# EAGLE design HAP-USB-Opto-1.0 (EAGLE 5.06)
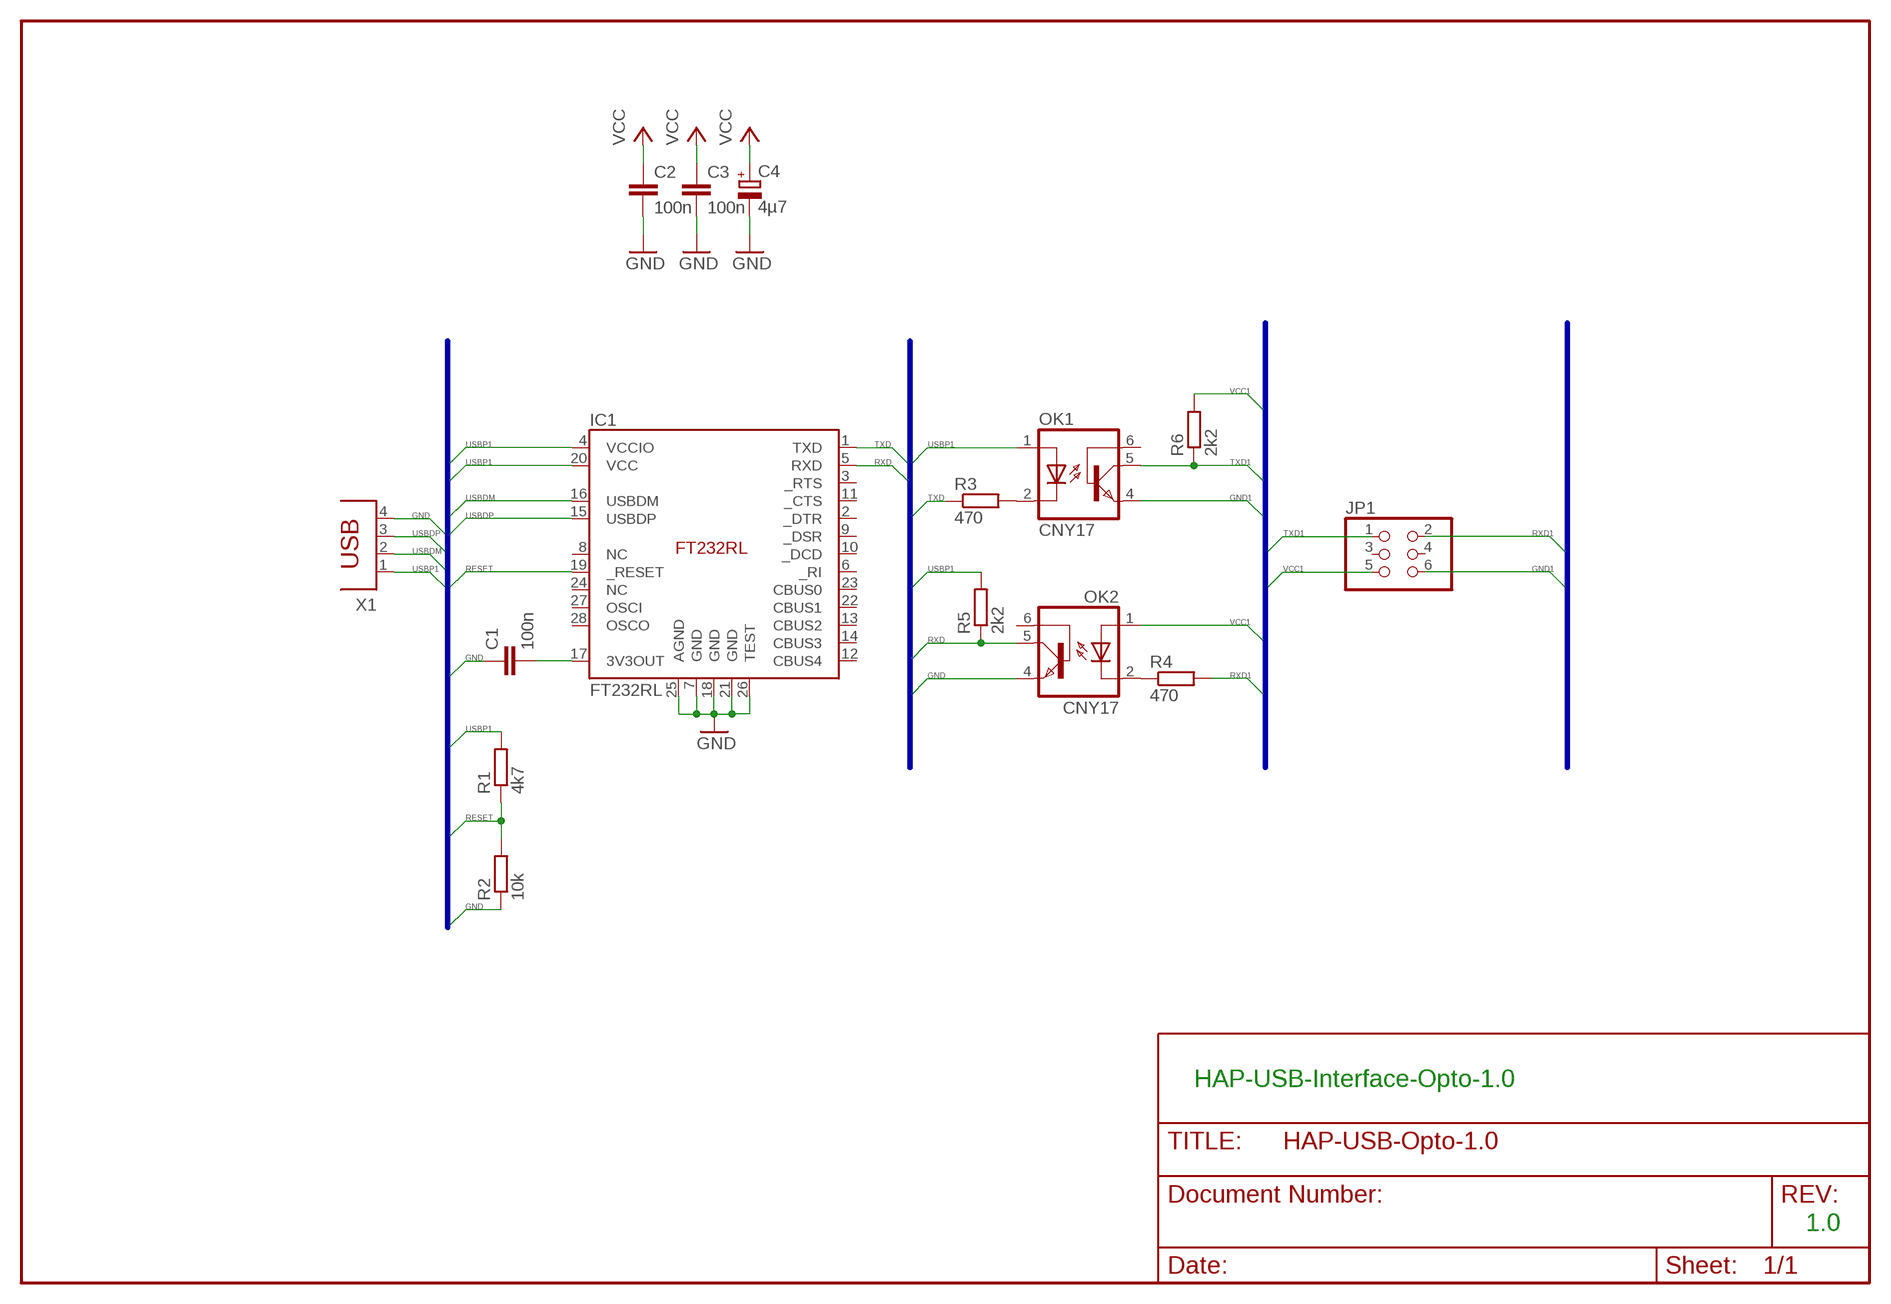
[diagram p0: schematic, sheet 1]

## Parts
C1  100n  C-EUC0805  [C0805]
C2  100n  C-EUC0805  [C0805]
C3  100n  C-EUC0805  [C0805]
C4  4µ7  CPOL-EUE2,5-6E  [E2,5-6E]
IC1  FT232RL  [SSOP-28]
JP1  PINHD-2X3  [2X03]
OK1  CNY17  [DIL06]
OK2  CNY17  [DIL06]
R1  4k7  R-EU_R0805  [R0805]
R2  10k  R-EU_R0805  [R0805]
R3  470  R-EU_R0805  [R0805]
R4  470  R-EU_R0805  [R0805]
R5  2k2  R-EU_R0805  [R0805]
R6  2k2  R-EU_R0805  [R0805]
X1  PN61729  [PN61729]

## Nets
GND: C1.1 C2.2 C3.2 C4.- IC1.7(GND) IC1.18(GND) IC1.21(GND) IC1.25(AGND) IC1.26(TEST) OK2.4(EMI) R2.1 X1.4
GND1: JP1.6 OK1.4(EMI)
N$1: OK1.2(C) R3.2
N$2: C1.2 IC1.17(3V3OUT)
N$3: OK2.2(C) R4.1
RESET: IC1.19(_RESET) R1.1 R2.2
RXD: IC1.5(RXD) OK2.5(COL) R5.1
RXD1: JP1.2 R4.2
TXD: IC1.1(TXD) R3.1
TXD1: JP1.1 OK1.5(COL) R6.1
USBDM: IC1.16(USBDM) X1.2
USBDP: IC1.15(USBDP) X1.3
USBP1: C2.1 C3.1 C4.+ IC1.4(VCCIO) IC1.20(VCC) OK1.1(A) R1.2 R5.2 X1.1 ; supply symbol labelled VCC
VCC1: JP1.5 OK2.1(A) R6.2
Unconnected: IC1.2(_DTR) IC1.3(_RTS) IC1.6(_RI) IC1.8(NC) IC1.9(_DSR) IC1.10(_DCD) IC1.11(_CTS) IC1.12(CBUS4) IC1.13(CBUS2) IC1.14(CBUS3) IC1.22(CBUS1) IC1.23(CBUS0) IC1.24(NC) IC1.27(OSCI) IC1.28(OSCO) JP1.3 JP1.4 OK1.6(BAS) OK2.6(BAS)

## Buses
VCC,GND,TXD,RXD,USBDM,USBDP,RESET,USBP1
B$1
B$2

## Notes on the sheet
- HAP-USB-Interface-Opto-1.0
- 1.0

## Library data of the parts
C1-C3 = rcl:C-EU: CAPACITOR, European symbol
C4 = rcl:CPOL-EU: POLARIZED CAPACITOR, European symbol
IC1 = ftdi4:FT232RL
JP1 = pinhead:PINHD-2X3: PIN HEADER
OK1 OK2 = optocoupler:CNY17: SIEMENS OPTO COUPLER
R1 R2 = rcl:R-EU_: RESISTOR, European symbol
R3-R6 = resistor:R-EU_: RESISTOR, European symbol
X1 = con-berg:PN61729: BERG USB connector

## Board
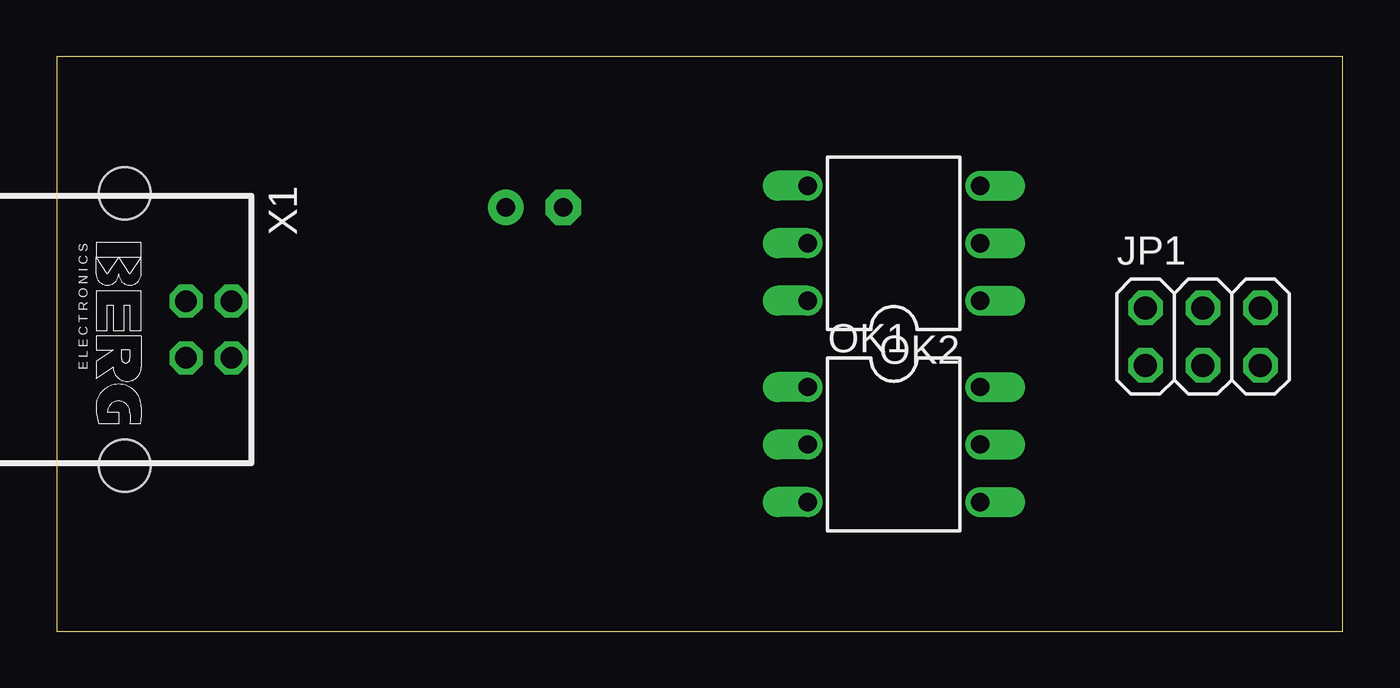
[diagram p1: board, top side]
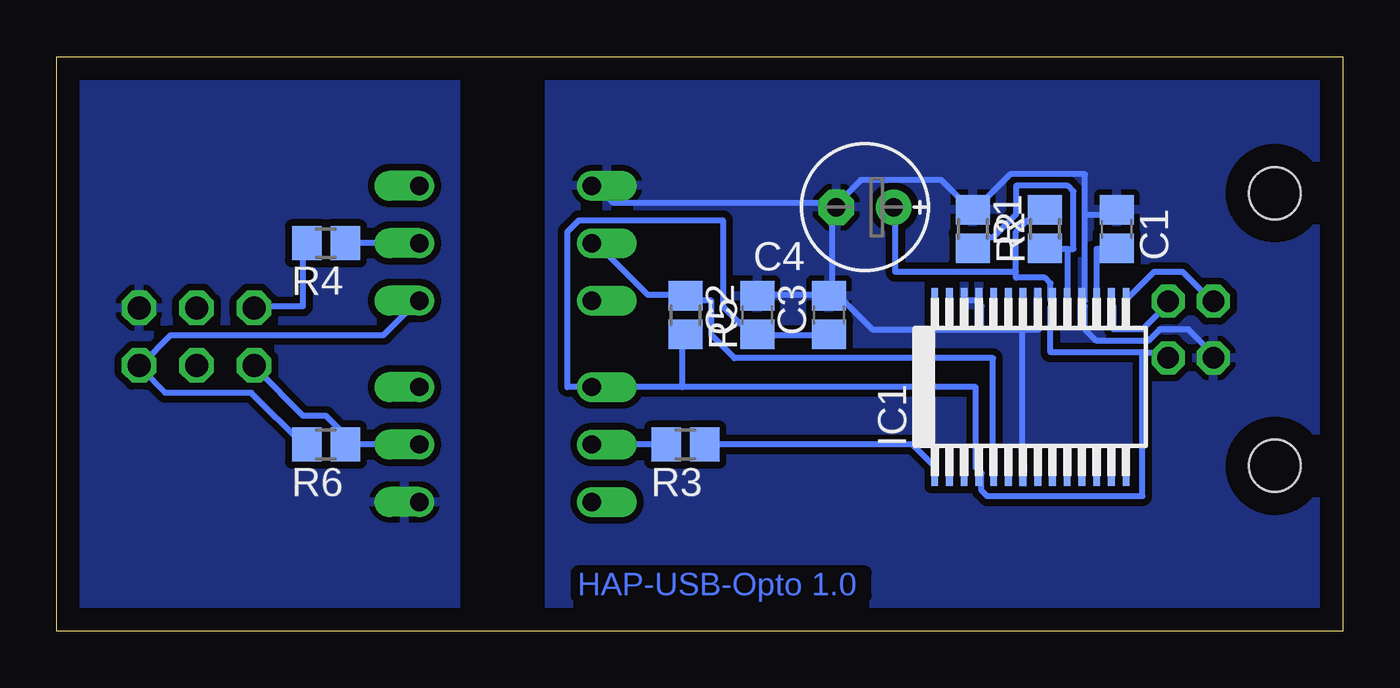
[diagram p2: board, bottom side, seen from below]

Size 56.82 x 25.39 mm. Coordinates in mm from the lower left corner, seen from the top.
Outline: 0,0 56.82,0 56.82,25.39 0,25.39 0,0
Copper layers (1*16): Top 0.035mm / dielectric 1.5mm / Bottom 0.035mm
Design rules "default": minimum track width 10mil, minimum drill 24mil, track to track 8mil, track to pad 8mil, pad to pad 8mil, via to via 8mil, smd to smd 8mil, copper to edge 40mil, drill to drill 8mil, minimum pad ring 10mil, minimum via ring 8mil, stop-mask expansion 4mil, vias tented up to drill 0mil, thermal gap 10mil

### Footprints (pad centres in the part's own frame; a part is rotated, then mirrored left to right if it is on the bottom)
C0805 = smd 1.3 x 1.5: 1 -0.85,0; 2 0.85,0
E2,5-6E = drill 0.813 pad 1.575 round: + -1.27,0 | drill 0.813 pad 1.575 octagon: - 1.27,0
SSOP-28 = smd 0.3 x 1.5: 1 -4.225,-3.625; 2 -3.575,-3.625; 3 -2.925,-3.625; 4 -2.275,-3.625; 5 -1.625,-3.625; 6 -0.975,-3.625; 7 -0.325,-3.625; 8 0.325,-3.625; 9 0.975,-3.625; 10 1.625,-3.625; 11 2.275,-3.625; 12 2.925,-3.625; 13 3.575,-3.625; 14 4.225,-3.625; 15 4.225,3.625; 16 3.575,3.625; 17 2.925,3.625; 18 2.275,3.625; 19 1.625,3.625; 20 0.975,3.625; 21 0.325,3.625; 22 -0.325,3.625; 23 -0.975,3.625; 24 -1.625,3.625; 25 -2.275,3.625; 26 -2.925,3.625; 27 -3.575,3.625; 28 -4.225,3.625
2X03 = drill 1.016 octagon: 1 -2.54,-1.27; 2 -2.54,1.27; 3 0,-1.27; 4 0,1.27; 5 2.54,-1.27; 6 2.54,1.27
DIL06 = drill 0.813 offset: 1 -2.54,-3.81; 2 0,-3.81; 3 2.54,-3.81; 4 2.54,3.81; 5 0,3.81; 6 -2.54,3.81
R0805 = smd 1.3 x 1.5: 1 -0.85,0; 2 0.85,0
PN61729 = drill 0.95 octagon: 1 1.25,4.71; 2 -1.25,4.71; 3 -1.25,2.71; 4 1.25,2.71 | hole 2.3: -6.02,0; 6.02,0

### Placement (x,y rotation side)
C1  10,17.77 270 bottom
C2  25.87,13.96 90 bottom
C3  22.7,13.96 90 bottom
C4  21.11,18.73 180 bottom
IC1  13.81,10.79 0 bottom
JP1  50.63,13.01 0 top
OK1  36.98,8.25 270 top
OK2  36.98,17.14 90 top
R1  13.17,17.77 90 bottom
R2  16.34,17.77 270 bottom
R3  29.04,8.25 180 bottom
R4  44.92,17.14 180 bottom
R5  29.04,13.96 270 bottom
R6  44.92,8.25 180 bottom
X1  3.01,13.33 270 top

### Tracks (layer width: path | path; a pad name or v marks a point on that pad's centre or on a via)
GND
  Bottom 0.254: 11.39,18.41 11.39,14.6 IC1.18 11.39,14.35 11.39,13.33 10.88,12.82 8.6,12.82 8.09,13.33 6.82,13.33 5.8,12.31 X1.4 | 11.39,18.41 10.12,18.41 C1.1 | 15.96,13.33 14.19,13.33 | 14.19,13.33 13.42,13.33 13.42,14.35 IC1.21 | 15.96,13.33 15.96,14.35 IC1.25 16.22,14.6 16.73,14.6 IC1.26 | 14.19,13.33 14.19,7.23 IC1.7 | C3.2 22.82,14.85 25.87,14.85 C2.2 | C4.- 22.31,18.92 21.3,19.93 17.74,19.93 16.47,18.66 R2.1 16.22,18.66 14.69,20.19 11.39,20.19 11.39,18.41 | C3.2 22.57,14.85 22.57,18.66 C4.- | OK2.4 32.98,19.68 32.22,18.92 22.57,18.92 C4.- | 15.96,13.33 20.79,13.33 22.06,14.6 22.57,14.6 C3.2
  pour Bottom (isolate 0.305): 0.15,25.4 35.08,25.4 35.08,0 0.15,0
GND1
  pour Bottom (isolate 0.305): 56.67,25.4 39.2,25.4 39.2,0 56.67,0
N$1
  Bottom 0.254: R3.2 OK1.2
N$2
  Bottom 0.254: IC1.17 10.88,14.6 10.88,16.89 10.12,16.89 C1.2
N$3
  Bottom 0.254: OK2.2 R4.1
RESET
  Bottom 0.254: 12.15,16.89 12.15,14.6 IC1.19 | 12.15,16.89 13.17,16.89 R1.1 | 12.15,16.89 11.9,16.89 11.9,19.43 12.15,19.68 14.44,19.68 14.44,18.41 15.46,17.39 15.96,17.39 16.22,17.14 R2.2
RXD
  Bottom 0.254: IC1.5 15.46,7.23 15.46,12.06 26.89,12.06 27.9,13.08 27.9,14.6 28.92,14.6 R5.1 29.17,14.85 30.7,14.85 32.98,17.14 OK2.5
RXD1
  Bottom 0.254: R4.2 45.94,17.14 45.94,14.35 47.97,14.35 JP1.2
TXD
  Bottom 0.254: IC1.1 18,7.23 19.01,8.25 R3.1
TXD1
  Bottom 0.254: OK1.5 43.65,8.25 | 43.65,8.25 44.92,9.52 45.94,9.52 47.97,11.55 JP1.1 | 43.65,8.25 R6.1
USBDM
  Bottom 0.254: IC1.16 10.12,14.35 10.12,13.33 8.85,13.33 7.84,14.35 X1.2
USBDP
  Bottom 0.254: IC1.15 9.61,14.6 8.34,15.87 7.07,15.87 5.8,14.6 X1.3
USBP1
  Bottom 0.254: 8.85,12.31 7.84,12.31 X1.1 | 8.85,12.31 12.92,12.31 12.92,14.35 IC1.20 12.92,14.6 12.92,15.36 13.17,15.62 14.44,15.62 14.44,15.87 | 14.44,15.87 14.44,17.65 13.93,18.16 13.42,18.16 13.17,18.41 R1.2 | 14.44,15.87 19.77,15.87 19.77,18.66 C4.+ | C3.1 22.82,13.08 25.87,13.08 C2.1 25.87,13.33 26.12,13.58 26.63,13.58 27.39,14.35 27.39,18.16 33.74,18.16 34.25,17.65 34.25,10.79 OK1.1 29.17,10.79 | 29.17,10.79 16.22,10.79 16.22,7.23 IC1.4 15.96,6.98 15.96,6.22 15.71,5.96 8.85,5.96 8.85,12.31 | 29.17,10.79 29.17,13.08 R5.2
VCC1
  Bottom 0.254: R6.2 45.94,8.25 48.22,10.54 52.03,10.54 53.05,11.55 JP1.5 53.05,11.81 51.78,13.08 42.38,13.08 40.86,14.6 OK2.1

### Text on the board
Bottom: HAP-USB-Opto 1.0